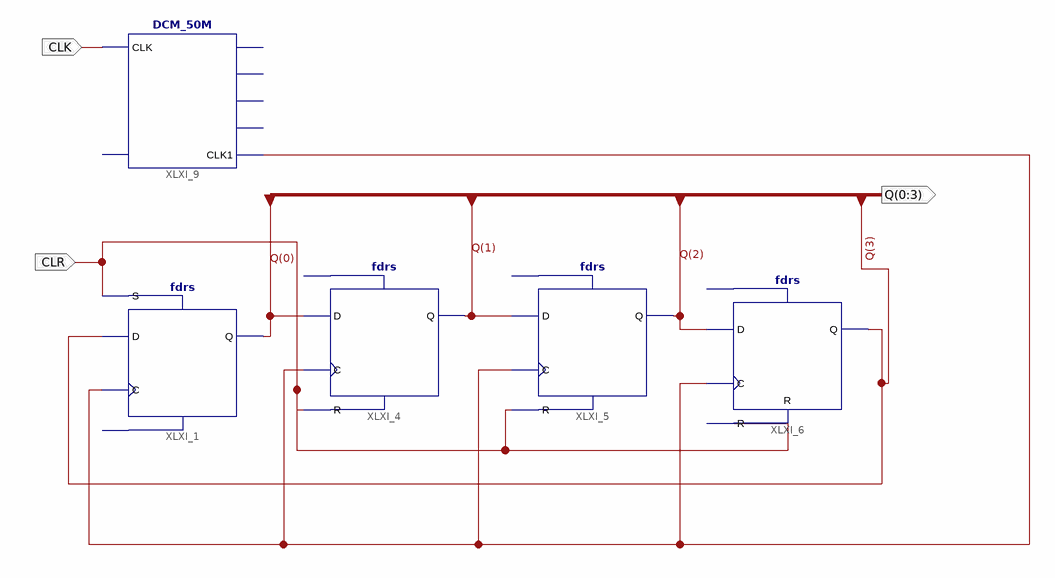
[diagram p0: schematic sheet 1]
// Xilinx ISE schematic Ringshifter.sch (spartan3e) as structural Verilog: 5 symbols, 3 ports
module Ringshifter (
  input  CLR,
  input  CLK,
  output [0:3] Q
);

  wire XLXN_33;

  fdrs XLXI_1 (.C(XLXN_33), .D(Q[3]), .S(CLR), .Q(Q[0]));  // open: R
  fdrs XLXI_4 (.C(XLXN_33), .D(Q[0]), .R(CLR), .Q(Q[1]));  // open: S
  fdrs XLXI_5 (.C(XLXN_33), .D(Q[1]), .R(CLR), .Q(Q[2]));  // open: S
  fdrs XLXI_6 (.C(XLXN_33), .D(Q[2]), .R(CLR), .Q(Q[3]));  // open: S
  DCM_50M XLXI_9 (.CLK(CLK), .CLK1(XLXN_33));  // open: RST, CLK1M, CLK10k, CLK1k, CLK100
endmodule
